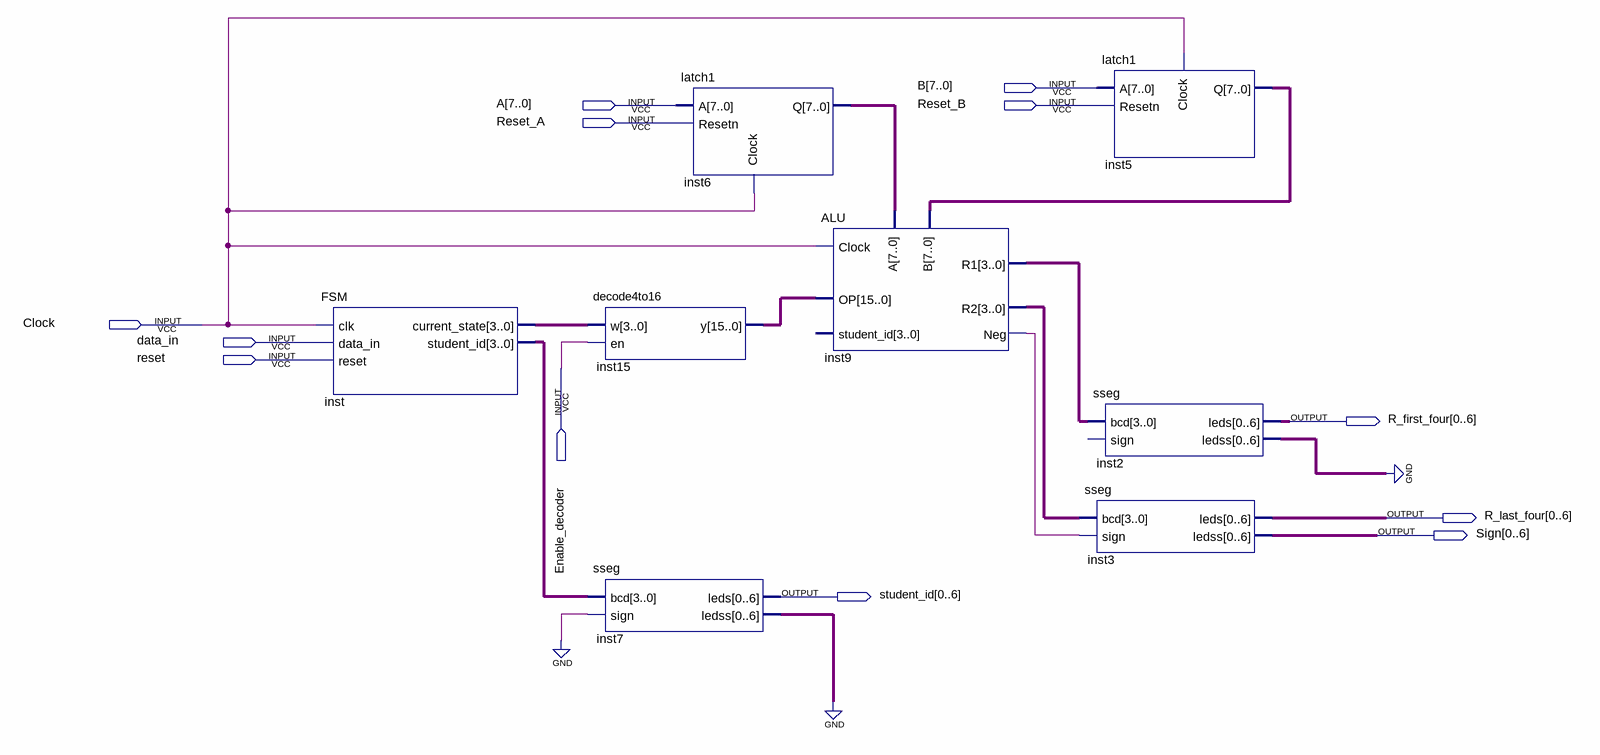
[diagram p0: schematic sheet]
// Quartus schematic FinalDiagram.bdf as structural Verilog: 8 symbols, 12 pins
module FinalDiagram (
  input  [7:0] B,
  input  [7:0] A,
  input  Reset_B,
  input  Reset_A,
  input  Clock,
  input  data_in,
  input  reset,
  input  Enable_decoder,
  output [0:6] R_first_four,
  output [0:6] R_last_four,
  output [0:6] Sign,
  output [0:6] student_id
);

  wire inst9_neg;
  wire [3:0] inst9_r1, inst9_r2, inst_current_state, inst_student_id;
  wire [6:0] inst2_ledss, inst7_ledss;
  wire [7:0] inst5_q, inst6_q;
  wire [15:0] inst15_y;

  FSM inst (
    .clk(Clock), .data_in(data_in), .reset(reset), .current_state(inst_current_state),
    .student_id(inst_student_id));
  decode4to16 inst15 (.w(inst_current_state), .en(Enable_decoder), .y(inst15_y));
  sseg inst7 (.bcd(inst_student_id), .sign(1'b0), .leds(student_id), .ledss(inst7_ledss));
  latch1 inst6 (.A(A), .Resetn(Reset_A), .Clock(Clock), .Q(inst6_q));
  ALU inst9 (
    .Clock(Clock), .A(inst6_q), .B(inst5_q), .OP(inst15_y), .Neg(inst9_neg), .R1(inst9_r1), .R2(inst9_r2));  // open: student_id
  latch1 inst5 (.A(B), .Resetn(Reset_B), .Clock(Clock), .Q(inst5_q));
  sseg inst2 (.bcd(inst9_r1), .leds(R_first_four), .ledss(inst2_ledss));  // open: sign
  sseg inst3 (.bcd(inst9_r2), .sign(inst9_neg), .leds(R_last_four), .ledss(Sign));
  // also tied to GND on the sheet: {inst2_ledss[0], inst2_ledss[1], inst2_ledss[2], inst2_ledss[3], inst2_ledss[4], inst2_ledss[5], inst2_ledss[6], inst7_ledss[0], inst7_ledss[1], inst7_ledss[2], inst7_ledss[3], inst7_ledss[4], inst7_ledss[5], inst7_ledss[6]}
endmodule
